# EAGLE design ul-12 (EAGLE 6.4)
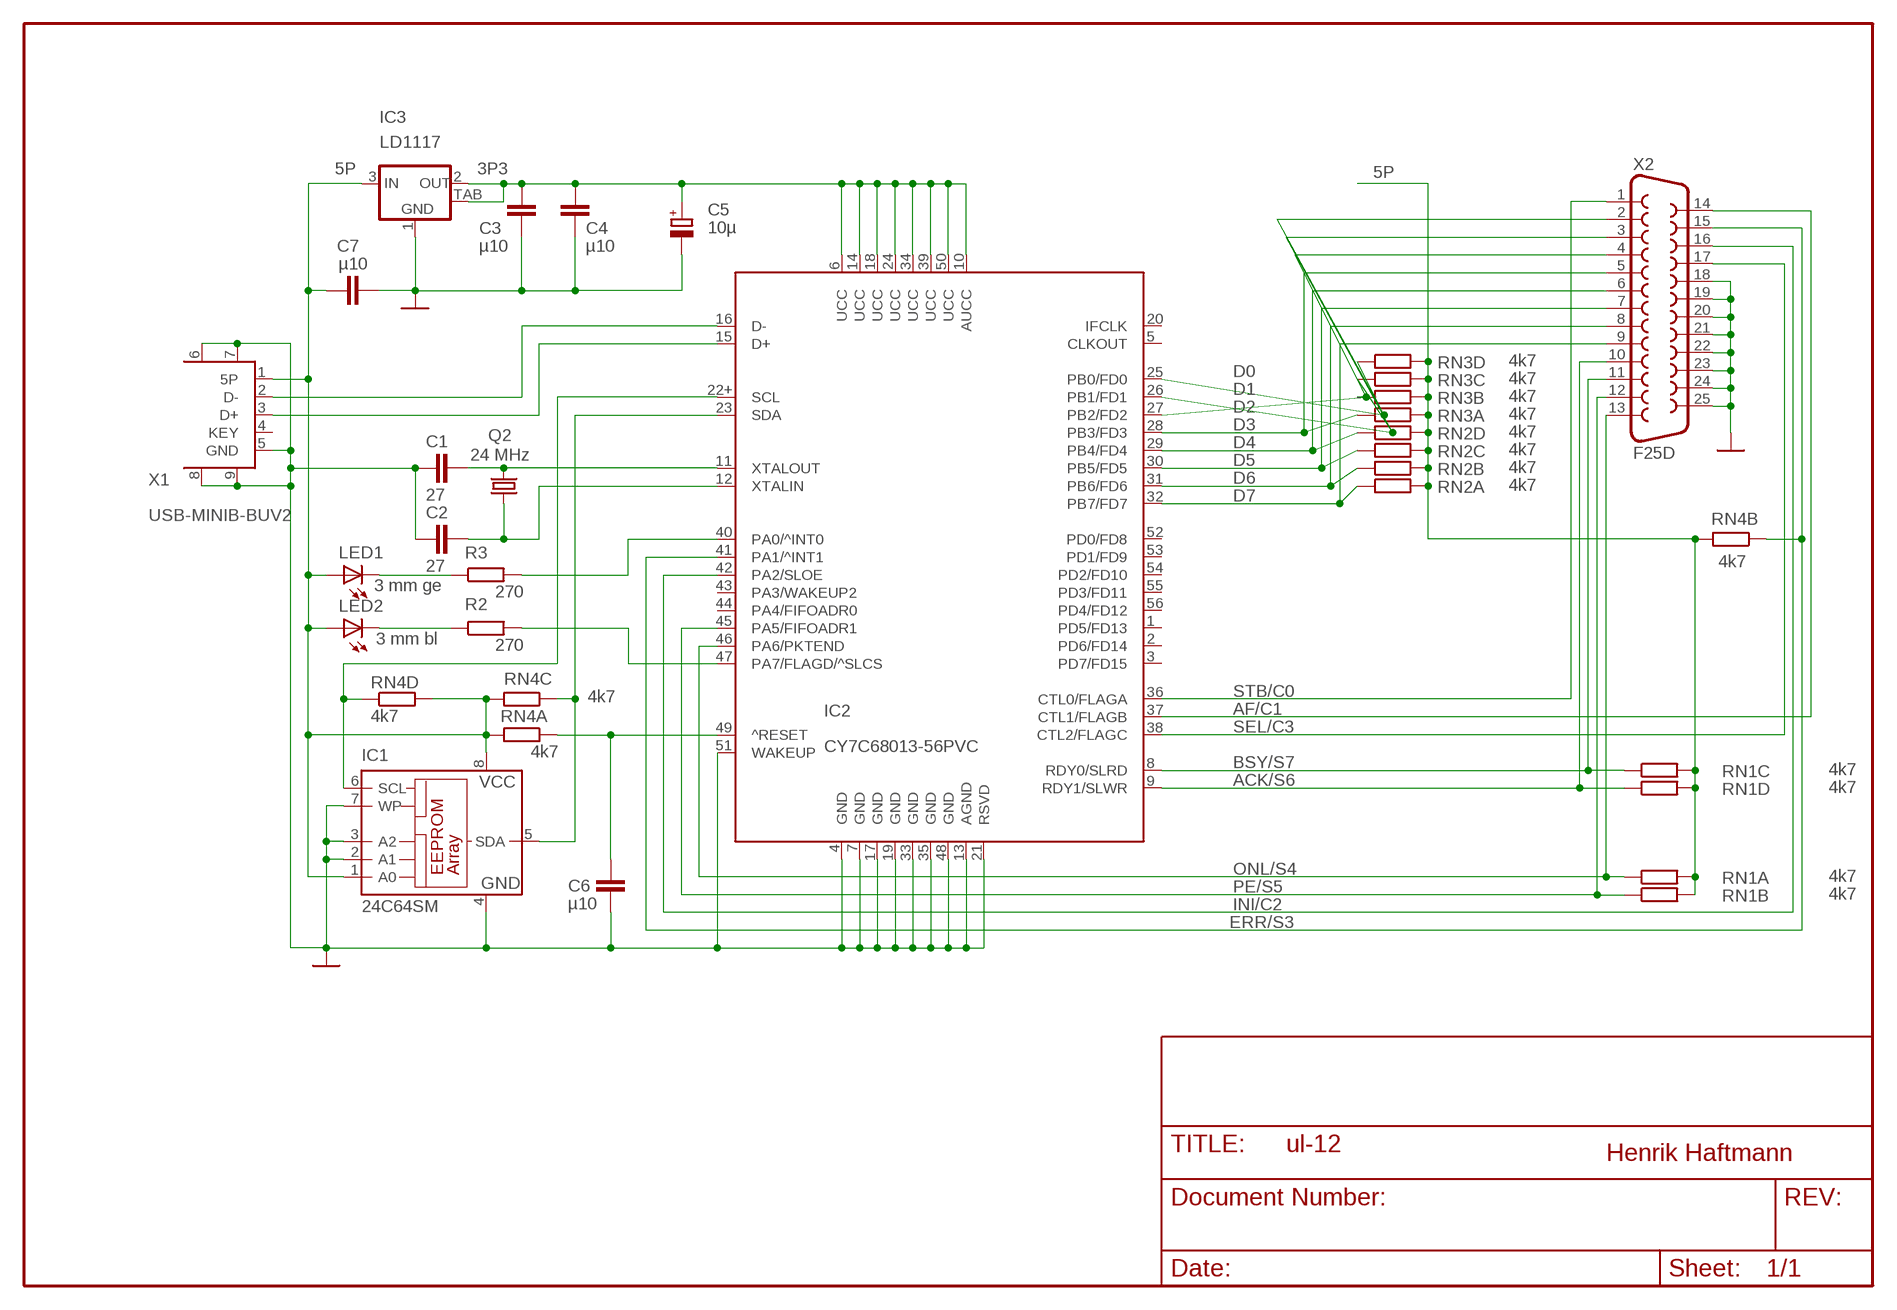
[diagram p0: schematic, sheet 1, part 1 of 2]
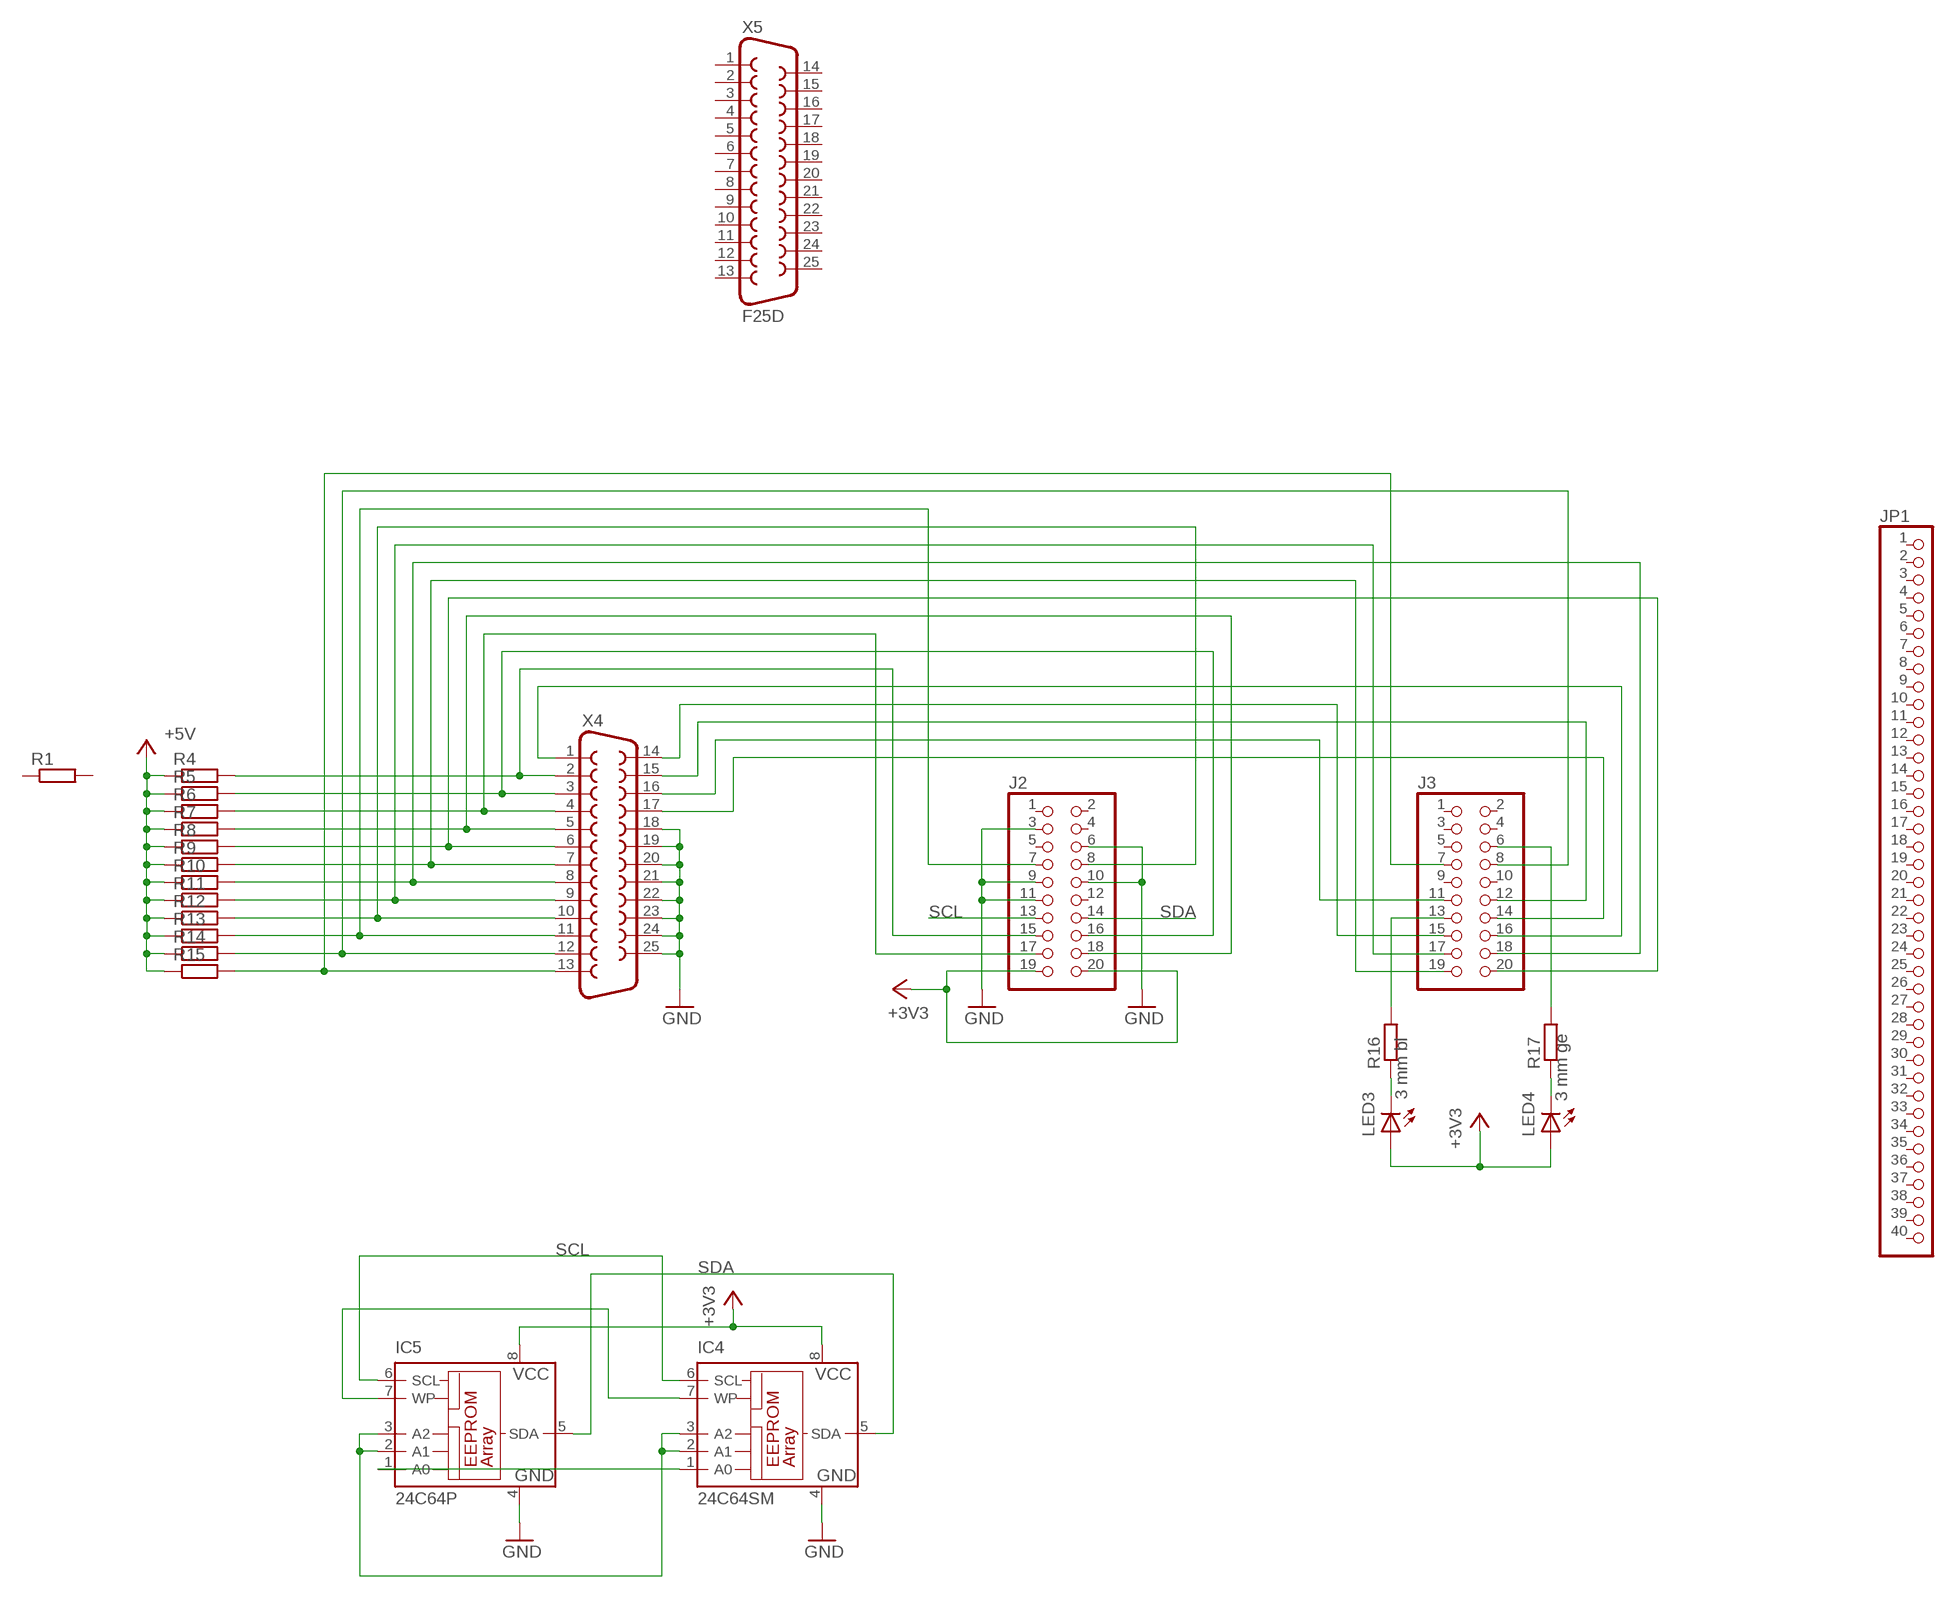
[diagram p1: schematic, sheet 1, part 2 of 2]

## Parts
C1  27  C-EUC0805  [C0805]
C2  27  C-EUC0805  [C0805]
C3  µ10  C-EUC0805  [C0805]
C4  µ10  C-EUC0805  [C0805]
C5  10µ  CPOL-EUC/6032-28R  [C/6032-28R]
C6  µ10  C-EUC0805  [C0805]
C7  µ10  C-EUC0805  [C0805]
IC1  24C64SM  [SO-08M]
IC2  CY7C68013-56PVC  [SSOP56]
IC3  LD1117  LD1117S  [SOT223]
IC4  24C64SM  [SO-08M]
IC5  24C64P  [DIL8]
J2  PINHD-2X10  [2X10]
J3  PINHD-2X10  [2X10]
JP1  PINHD-1X40  [1X40]
LED1  3 mm ge  LED3MM  [LED3MM]
LED2  3 mm bl  LED3MM  [LED3MM]
LED3  3 mm bl  LED3MM  [LED3MM]
LED4  3 mm ge  LED3MM  [LED3MM]
Q2  24 MHz  CRYTALHC49U-V  [HC49U-V]
R1  R-EU_R0805  [R0805]
R2  270  R-EU_R0805  [R0805]
R3  270  R-EU_R0805  [R0805]
R4  R-EU_R0805  [R0805]
R5  R-EU_R0805  [R0805]
R6  R-EU_R0805  [R0805]
R7  R-EU_R0805  [R0805]
R8  R-EU_R0805  [R0805]
R9  R-EU_R0805  [R0805]
R10  R-EU_R0805  [R0805]
R11  R-EU_R0805  [R0805]
R12  R-EU_R0805  [R0805]
R13  R-EU_R0805  [R0805]
R14  R-EU_R0805  [R0805]
R15  R-EU_R0805  [R0805]
R16  R-EU_R0805  [R0805]
R17  R-EU_R0805  [R0805]
RN1  4k7  RN-4P1206  [R-4P]
RN2  4k7  RN-4P1206  [R-4P]
RN3  4k7  RN-4P1206  [R-4P]
RN4  4k7  RN-4P1206  [R-4P]
X1  USB-MINIB-BUV2  [USB-MINIB-BUO]
X2  F25D  [F25D]
X4  F25HP  [F25HP]
X5  F25D  [F25D]

## Nets
3P3: C3.2 C4.2 C5.+ IC2.6(UCC) IC2.10(AUCC) IC2.14(UCC) IC2.18(UCC) IC2.24(UCC) IC2.34(UCC) IC2.39(UCC) IC2.50(UCC) IC3.2(OUT) IC3.TAB(OUT)
5P: C7.2 IC1.1(A0) IC1.8(VCC) IC3.3(IN) LED1.A LED2.A RN1.5 RN1.6 RN1.7 RN1.8 RN2.5 RN2.6 RN2.7 RN2.8 RN3.5 RN3.6 RN3.7 RN3.8 RN4.5 RN4.6 RN4.7 RN4.8 X1.1(5P)
+3V3: IC4.8(VCC) IC5.8(VCC) J2.19 J2.20 LED3.A LED4.A
+5V: R4.1 R5.1 R6.1 R7.1 R8.1 R9.1 R10.1 R11.1 R12.1 R13.1 R14.1 R15.1
ACK/S6: IC2.9(RDY1/SLWR) RN1.4 X2.10
AF/C1: IC2.37(CTL1/FLAGB) X2.14
BSY/S7: IC2.8(RDY0/SLRD) RN1.3 X2.11
D0: IC2.25(PB0/FD0) RN3.4 X2.2
D1: IC2.26(PB1/FD1) RN3.3 X2.3
D2: IC2.27(PB2/FD2) RN3.2 X2.4
D3: IC2.28(PB3/FD3) RN3.1 X2.5
D4: IC2.29(PB4/FD4) RN2.4 X2.6
D5: IC2.30(PB5/FD5) RN2.3 X2.7
D6: IC2.31(PB6/FD6) RN2.2 X2.8
D7: IC2.32(PB7/FD7) RN2.1 X2.9
ERR/S3: IC2.41(PA1/^INT1) RN4.2 X2.15
GND: C1.2 C2.2 C3.1 C4.1 C5.- C6.1 C7.1 IC1.2(A1) IC1.3(A2) IC1.4(GND) IC1.7(WP) IC2.4(GND) IC2.7(GND) IC2.13(AGND) IC2.17(GND) IC2.19(GND) IC2.21(RSVD) IC2.33(GND) IC2.35(GND) IC2.48(GND) IC2.51(WAKEUP) IC3.1(GND) IC4.4(GND) IC5.4(GND) J2.3 J2.6 J2.9 J2.10 J2.11 X1.5(GND) X1.6(GND) X1.7(GND) X1.8(GND) X1.9(GND) X2.18 X2.19 X2.20 X2.21 X2.22 X2.23 X2.24 X2.25 X4.18 X4.19 X4.20 X4.21 X4.22 X4.23 X4.24 X4.25
INI/C2: IC2.42(PA2/SLOE) X2.16
N$1: C2.1 IC2.12(XTALIN) Q2.1
N$2: C1.1 IC2.11(XTALOUT) Q2.2
N$3: IC2.16(D-) X1.2(D-)
N$4: C6.2 IC2.49(^RESET) RN4.1
N$5: LED2.K(C) R2.1
N$6: J3.16 X4.1
N$7: LED1.K(C) R3.1
N$8: IC2.47(PA7/FLAGD/^SLCS) R2.2
N$9: IC2.40(PA0/^INT0) R3.2
N$10: IC1.5(SDA) IC2.23(SDA) RN4.3
N$11: IC1.6(SCL) IC2.22+(SCL) RN4.4
N$12: J2.15 R4.2 X4.2
N$13: J2.16 R5.2 X4.3
N$14: J2.17 R6.2 X4.4
N$15: J2.18 R7.2 X4.5
N$16: J3.20 R8.2 X4.6
N$17: J3.19 R9.2 X4.7
N$18: J3.18 R10.2 X4.8
N$19: J3.17 R11.2 X4.9
N$20: J2.8 R12.2 X4.10
N$21: J2.7 R13.2 X4.11
N$22: J3.8 R14.2 X4.12
N$23: J3.7 R15.2 X4.13
N$24: IC4.7(WP) IC5.7(WP)
N$25: J3.13 R16.2
N$26: LED3.K(C) R16.1
N$27: J3.6 R17.2
N$28: LED4.K(C) R17.1
N$29: IC2.15(D+) X1.3(D+)
N$37: J3.14 X4.17
N$38: J3.11 X4.16
N$39: J3.12 X4.15
N$40: J3.15 X4.14
N$49: IC4.1(A0) IC5.1(A0)
N$50: IC4.2(A1) IC4.3(A2) IC5.2(A1) IC5.3(A2)
ONL/S4: IC2.46(PA6/PKTEND) RN1.1 X2.13
PE/S5: IC2.45(PA5/FIFOADR1) RN1.2 X2.12
SCL: IC4.6(SCL) IC5.6(SCL) J2.13
SDA: IC4.5(SDA) IC5.5(SDA) J2.14
SEL/C3: IC2.38(CTL2/FLAGC) X2.17
STB/C0: IC2.36(CTL0/FLAGA) X2.1
Unconnected: IC2.1(PD5/FD13) IC2.2(PD6/FD14) IC2.3(PD7/FD15) IC2.5(CLKOUT) IC2.20(IFCLK) IC2.43(PA3/WAKEUP2) IC2.44(PA4/FIFOADR0) IC2.52(PD0/FD8) IC2.53(PD1/FD9) IC2.54(PD2/FD10) IC2.55(PD3/FD11) IC2.56(PD4/FD12) J2.1 J2.2 J2.4 J2.5 J2.12 J3.1 J3.2 J3.3 J3.4 J3.5 J3.9 J3.10 JP1.1 JP1.2 JP1.3 JP1.4 JP1.5 JP1.6 JP1.7 JP1.8 JP1.9 JP1.10 JP1.11 JP1.12 JP1.13 JP1.14 JP1.15 JP1.16 JP1.17 JP1.18 JP1.19 JP1.20 JP1.21 JP1.22 JP1.23 JP1.24 JP1.25 JP1.26 JP1.27 JP1.28 JP1.29 JP1.30 JP1.31 JP1.32 JP1.33 JP1.34 JP1.35 JP1.36 JP1.37 JP1.38 JP1.39 JP1.40 R1.1 R1.2 X1.4(KEY) X5.1 X5.2 X5.3 X5.4 X5.5 X5.6 X5.7 X5.8 X5.9 X5.10 X5.11 X5.12 X5.13 X5.14 X5.15 X5.16 X5.17 X5.18 X5.19 X5.20 X5.21 X5.22 X5.23 X5.24 X5.25

## Notes on the sheet
- Henrik Haftmann

## Library data of the parts
C1-C4 C6 C7 = rcl:C-EU: CAPACITOR, European symbol
C5 = rcl:CPOL-EU: POLARIZED CAPACITOR, European symbol
IC1 IC4 IC5 = microchip:24*: Serial EEPROM I2C
IC2 = hs-ul:CY7C68013-56: FX2
IC3 = hs-ul:LD1117: LD1117 Reichelt - Digikey 0,62
J2 J3 = pinhead:PINHD-2X10: PIN HEADER
JP1 = pinhead:PINHD-1X40: PIN HEADER
LED1-LED4 = led:LED: LED OSRAM: - CHIPLED LG R971, LG N971, LY N971, LG Q971, LY Q971, LO R971, LY R971 LH N974, LH R974 LS Q976, LO Q976, LY Q976 LO Q996 - Hyper CHIPLED LW Q18S LB Q993, LB Q99A, LB R99A - SideLED LS A670, LO A670, LY A670, LG A670, LP A670 LB A673, LV A673, LT A673, LW A673 LH A674 LY A675 LS A676, LA A676, LO A676, LY A676, LW A676 LS A679, LY A679, LG A679 - Hyper Micro SIDELED® LS Y876, LA Y876, LO Y876, LY Y876 LT Y87S - SmartLED LW L88C, LW L88S LB L89C, LB L89S, LG L890 LS L89K, LO L89K, LY L89K LS L896, LA L896, LO L896, LY L896 - TOPLED LS T670, LO T670, LY T670, LG T670, LP T670 LSG T670, LSP T670, LSY T670, LOP T670, LYG T670 LG T671, LOG T671, LSG T671 LB T673, LV T673, LT T673, LW T673 LH T674 LS T676, LA T676, LO T676, LY T676, LB T676, LH T676, LSB T676, LW T676 LB T67C, LV T67C, LT T67C, LS T67K, LO T67K, LY T67K, LW E67C LS E67B, LA E67B, LO E67B, LY E67B, LB E67C, LV E67C, LT E67C LW T67C LS T679, LY T679, LG T679 LS T770, LO T770, LY T770, LG T770, LP T770 LB T773, LV T773, LT T773, LW T773 LH T774 LS E675, LA E675, LY E675, LS T675 LS T776, LA T776, LO T776, LY T776, LB T776 LHGB T686 LT T68C, LB T68C - Hyper Mini TOPLED® LB M676 - Mini TOPLED Santana® LG M470 LS M47K, LO M47K, LY M47K Source: http://www.osram.convergy.de/
Q2 = crystal:CRYTAL: CRYSTAL
R1-R17 = rcl:R-EU_: RESISTOR, European symbol
RN1-RN4 = hs-ul:RN-4P: Widerstandsnetzwerk 4 Parallel
X1 = hs-ul:USB-MINIB-BU: USB-MiniB-Buchse Oberflächenmontage irregulär von unten in Leiterplatten-Ausschnitt
X2 X5 = hs-ul:F25: SubD-Buchse korrigiert und verschönert
X4 = con-subd:F25: SUB-D; OC_FARNELL: unknown; OC_NEWARK: unknown

## Board
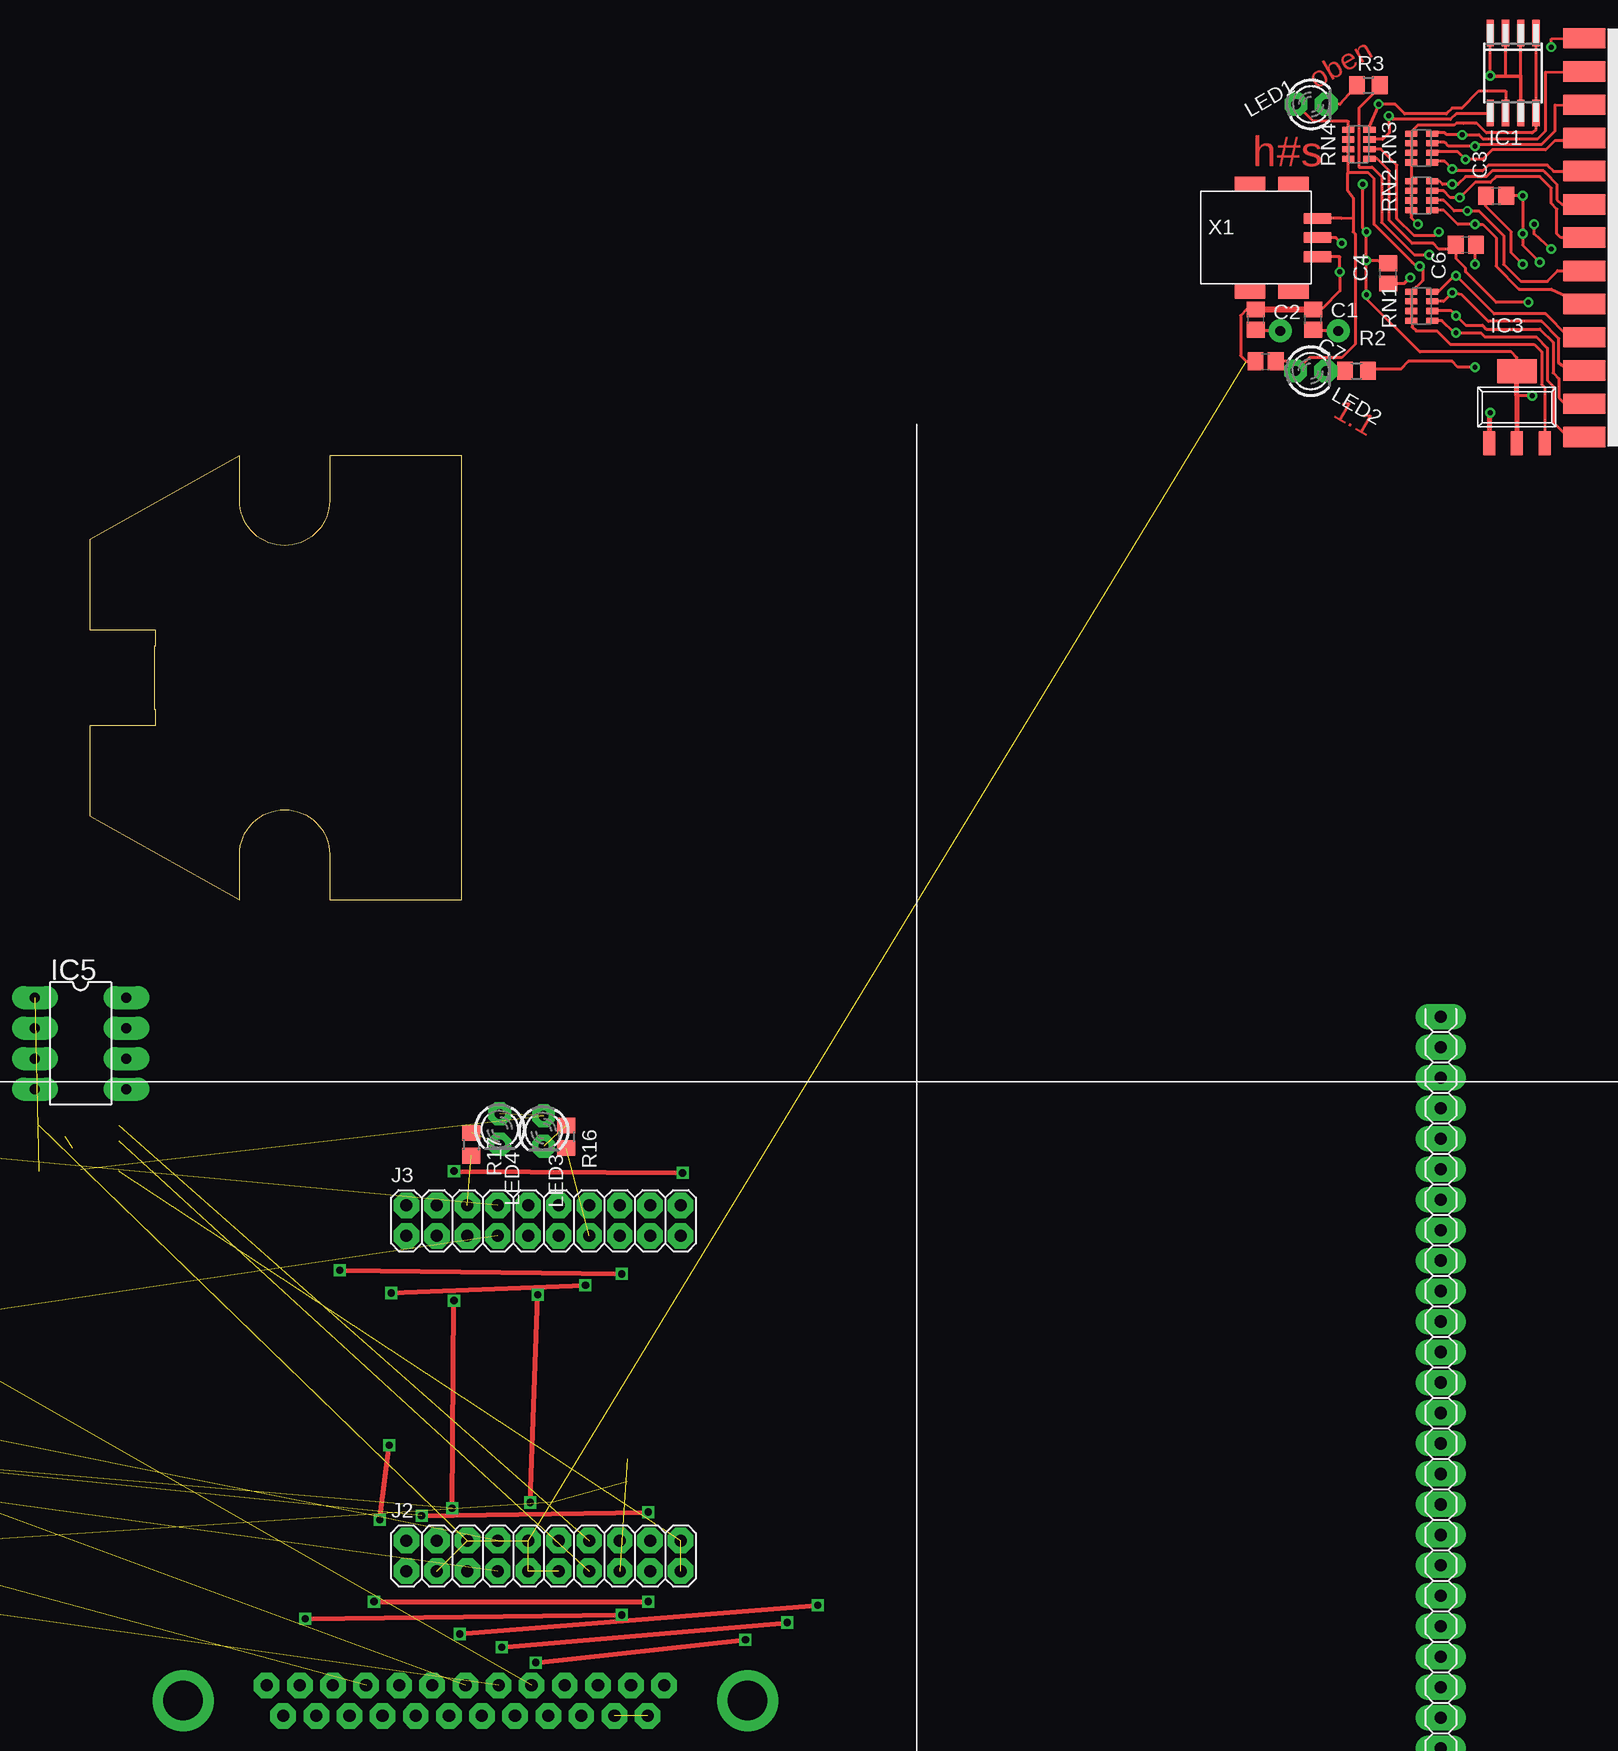
[diagram p2: board, top side]
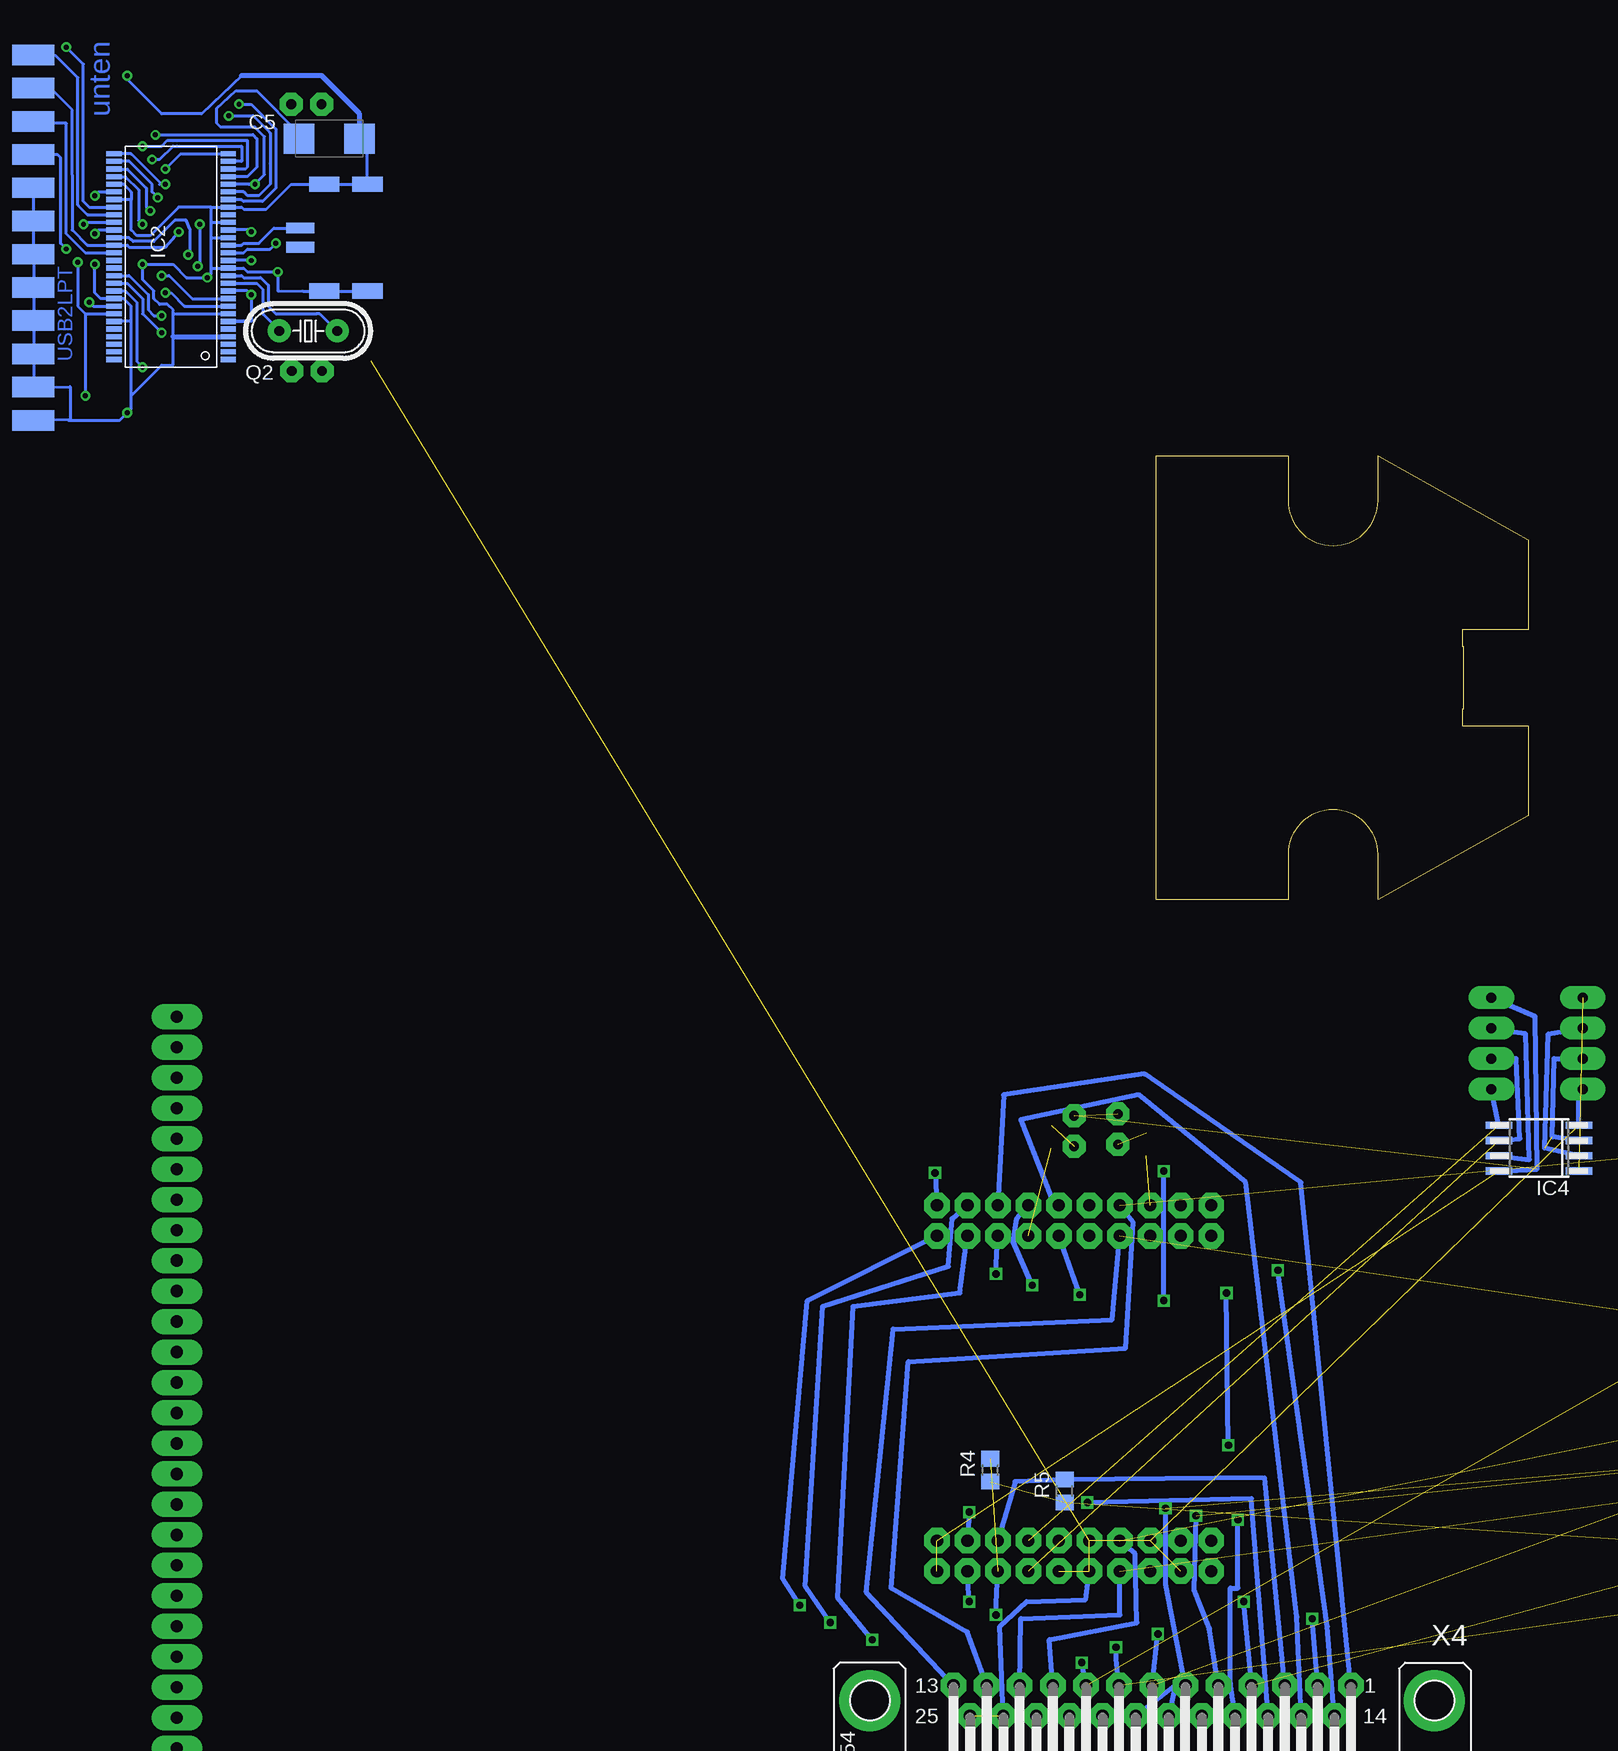
[diagram p3: board, bottom side, seen from below]

Size 31 x 37 mm. Coordinates in mm from the lower left corner, seen from the top.
Outline: 31,0 31,37 20,37 20,33.25 arc-90 16.25,29.5 arc-90 12.5,33.25 12.5,37 0,30 0,22.5 5.46,22.5 5.46,21.14 5.39,21.14 5.39,15.87 5.46,15.87 5.46,14.5 0,14.5 0,7 12.5,0 12.5,3.75 arc-180 20,3.75 20,0 31,0
Copper layers (1*16): Top 0.035mm / dielectric 1.5mm / Bottom 0.035mm
Design rules "DesignRules": minimum track width 8mil, minimum drill 24mil, track to track 0.2mm, track to pad 0.2mm, pad to pad 8mil, via to via 8mil, smd to smd 8mil, copper to edge 10mil, drill to drill 8mil, minimum pad ring 0.55mm, minimum via ring 8mil, stop-mask expansion 4mil, vias tented up to drill 0mil, thermal gap 10mil

### Footprints (pad centres in the part's own frame; a part is rotated, then mirrored left to right if it is on the bottom)
C0805 = smd 1.3 x 1.5: 1 -0.85,0; 2 0.85,0
C/6032-28R = smd 2.55 x 2.5: + 2.525,0; - -2.525,0
SO-08M = smd 0.6 x 2.2: 1 -1.905,-3.33; 2 -0.635,-3.33; 3 0.635,-3.33; 4 1.905,-3.33; 5 1.905,3.33; 6 0.635,3.33; 7 -0.635,3.33; 8 -1.905,3.33
SSOP56 = smd 1.27 x 0.432: 1 -4.763,8.572; 2 -4.763,7.938; 3 -4.763,7.303; 4 -4.763,6.668; 5 -4.763,6.032; 6 -4.763,5.397; 7 -4.763,4.763; 8 -4.763,4.128; 9 -4.763,3.493; 10 -4.763,2.857; 11 -4.763,2.223; 12 -4.763,1.587; 13 -4.763,0.953; 14 -4.763,0.318; 15 -4.763,-0.318; 16 -4.763,-0.953; 17 -4.763,-1.587; 18 -4.763,-2.223; 19 -4.763,-2.857; 20 -4.763,-3.493; 21 -4.763,-4.128; 22+ -4.763,-4.763; 23 -4.763,-5.397; 24 -4.763,-6.032; 25 -4.763,-6.668; 26 -4.763,-7.303; 27 -4.763,-7.938; 28 -4.763,-8.572; 29 4.763,-8.572; 30 4.763,-7.938; 31 4.763,-7.303; 32 4.763,-6.668; 33 4.763,-6.032; 34 4.763,-5.397; 35 4.763,-4.763; 36 4.763,-4.128; 37 4.763,-3.493; 38 4.763,-2.857; 39 4.763,-2.223; 40 4.763,-1.587; 41 4.763,-0.953; 42 4.763,-0.318; 43 4.763,0.318; 44 4.763,0.953; 45 4.763,1.587; 46 4.763,2.223; 47 4.763,2.857; 48 4.763,3.493; 49 4.763,4.128; 50 4.763,4.763; 51 4.763,5.397; 52 4.763,6.032; 53 4.763,6.668; 54 4.763,7.303; 55 4.763,7.938; 56 4.763,8.572
SOT223 = smd 1 x 2: 1 -2.3,-3; 2 0,-3; 3 2.3,-3 | smd 3.3 x 2: TAB 0,3
DIL8 = drill 0.813 long: 1 -3.81,-3.81; 2 -1.27,-3.81; 3 1.27,-3.81; 4 3.81,-3.81; 5 3.81,3.81; 6 1.27,3.81; 7 -1.27,3.81; 8 -3.81,3.81
2X10 = drill 1.016 octagon: 1 -11.43,-1.27; 2 -11.43,1.27; 3 -8.89,-1.27; 4 -8.89,1.27; 5 -6.35,-1.27; 6 -6.35,1.27; 7 -3.81,-1.27; 8 -3.81,1.27; 9 -1.27,-1.27; 10 -1.27,1.27; 11 1.27,-1.27; 12 1.27,1.27; 13 3.81,-1.27; 14 3.81,1.27; 15 6.35,-1.27; 16 6.35,1.27; 17 8.89,-1.27; 18 8.89,1.27; 19 11.43,-1.27; 20 11.43,1.27
1X40 = drill 1.016 long: 1 -49.53,0; 2 -46.99,0; 3 -44.45,0; 4 -41.91,0; 5 -39.37,0; 6 -36.83,0; 7 -34.29,0; 8 -31.75,0; 9 -29.21,0; 10 -26.67,0; 11 -24.13,0; 12 -21.59,0; 13 -19.05,0; 14 -16.51,0; 15 -13.97,0; 16 -11.43,0; 17 -8.89,0; 18 -6.35,0; 19 -3.81,0; 20 -1.27,0; 21 1.27,0; 22 3.81,0; 23 6.35,0; 24 8.89,0; 25 11.43,0; 26 13.97,0; 27 16.51,0; 28 19.05,0; 29 21.59,0; 30 24.13,0; 31 26.67,0; 32 29.21,0; 33 31.75,0; 34 34.29,0; 35 36.83,0; 36 39.37,0; 37 41.91,0; 38 44.45,0; 39 46.99,0; 40 49.53,0
LED3MM = drill 0.813 octagon: A -1.27,0; K 1.27,0
HC49U-V = drill 0.813: 1 -2.413,0; 2 2.413,0
R0805 = smd 1.3 x 1.5: 1 -0.95,0; 2 0.95,0
R-4P = smd 0.508 x 1.016: 1 -1.2,-0.88; 2 -0.4,-0.88; 3 0.4,-0.88; 4 1.2,-0.88; 5 1.2,0.88; 6 0.4,0.88; 7 -0.4,0.88; 8 -1.2,0.88
USB-MINIB-BUO = smd 2.311 x 0.889: 1 9.12,1.6; 3 9.12,0; 5 9.12,-1.6 | smd 2.311 x 0.889 bottom: 2 9.12,0.8; 4 9.12,-0.8 | smd 2.54 x 1.27 bottom: 6 3.52,4.45; 7 7.115,4.45; 8 7.115,-4.45; 9 3.52,-4.45 | smd 2.54 x 1.27: 6@ 3.52,4.45; 7@ 7.115,4.45; 8@ 7.115,-4.45; 9@ 3.52,-4.45
F25D = smd 1.7 x 3.5: 1 -16.612,-2.249; 2 -13.843,-2.249; 3 -11.074,-2.249; 4 -8.306,-2.249; 5 -5.537,-2.249; 6 -2.769,-2.249; 7 0,-2.249; 8 2.769,-2.249; 9 5.537,-2.249; 10 8.306,-2.249; 11 11.074,-2.249; 12 13.843,-2.249; 13 16.612,-2.249 | smd 1.7 x 3.5 bottom: 14 -15.227,-2.249; 15 -12.459,-2.249; 16 -9.69,-2.249; 17 -6.921,-2.249; 18 -4.153,-2.249; 19 -1.384,-2.249; 20 1.384,-2.249; 21 4.153,-2.249; 22 6.921,-2.249; 23 9.69,-2.249; 24 12.459,-2.249; 25 15.227,-2.249
F25HP = drill 1.016 octagon: 1 -16.561,-1.27; 2 -13.792,-1.27; 3 -11.049,-1.27; 4 -8.28,-1.27; 5 -5.512,-1.27; 6 -2.769,-1.27; 7 0,-1.27; 8 2.769,-1.27; 9 5.512,-1.27; 10 8.28,-1.27; 11 11.049,-1.27; 12 13.792,-1.27; 13 16.561,-1.27; 14 -15.189,1.27; 15 -12.421,1.27; 16 -9.652,1.27; 17 -6.909,1.27; 18 -4.14,1.27; 19 -1.372,1.27; 20 1.372,1.27; 21 4.14,1.27; 22 6.909,1.27; 23 9.652,1.27; 24 12.421,1.27; 25 15.189,1.27 | drill 3.302 pad 5.08: G1 -23.52,0; G2 23.52,0

### Placement (x,y rotation side)
C1  101.96,48.35 90 top  (outside the outline)
C2  97.2,48.35 90 top  (outside the outline)
C3  117.2,58.66 0 top  (outside the outline)
C4  108.22,52.19 90 top  (outside the outline)
C5  99.9,63.43 180 bottom  (outside the outline)
C6  114.69,54.56 180 top  (outside the outline)
C7  97.99,44.85 0 top  (outside the outline)
IC1  118.63,68.89 180 top  (outside the outline)
IC2  113.07,53.58 180 bottom  (outside the outline)
IC3  118.95,41.04 0 top  (outside the outline)
IC4  -0.91,-20.71 90 bottom  (outside the outline)
IC5  -0.75,-11.98 270 top  (outside the outline)
J2  37.83,-54.68 0 top  (outside the outline)
J3  37.83,-26.74 0 top  (outside the outline)
JP1  112.6,-59.29 90 top  (outside the outline)
LED1  101.8,66.28 0 top  (outside the outline)
LED2  101.76,44.06 0 top  (outside the outline)
LED3  37.83,-19.28 270 top  (outside the outline)
LED4  34.17,-19.12 270 top  (outside the outline)
Q2  101.64,47.39 180 bottom  (outside the outline)
R1  -18.85,-48.97 90 bottom  (outside the outline)
R2  105.57,44.06 0 top  (outside the outline)
R3  106.56,67.87 0 top  (outside the outline)
R4  44.81,-47.54 90 bottom  (outside the outline)
R5  38.62,-49.29 90 bottom  (outside the outline)
R6  -31.23,-51.67 90 bottom  (outside the outline)
R7  -42.5,-45.16 90 bottom  (outside the outline)
R8  -46.63,-45.16 90 bottom  (outside the outline)
R9  -44.88,-38.33 90 bottom  (outside the outline)
R10  -28.69,-55.64 270 bottom  (outside the outline)
R11  -40.44,-22.3 90 bottom  (outside the outline)
R12  -66.16,-34.2 90 bottom  (outside the outline)
R13  -65.04,-43.25 90 bottom  (outside the outline)
R14  -77.74,-15.95 90 bottom  (outside the outline)
R15  -75.52,-45.16 90 bottom  (outside the outline)
R16  39.73,-19.76 270 top  (outside the outline)
R17  31.79,-20.39 270 top  (outside the outline)
RN1  111.01,49.46 90 top  (outside the outline)
RN2  111.01,58.66 90 top  (outside the outline)
RN3  111.01,62.63 90 top  (outside the outline)
RN4  105.77,62.95 90 top  (outside the outline)
X1  93.2,55.17 0 top  (outside the outline)
X2  126.82,55.17 270 top  (outside the outline)
X4  31.32,-66.75 180 bottom  (outside the outline)
X5  146.57,7.71 0 top  (outside the outline)

### Tracks (layer width: path | path; a pad name or v marks a point on that pad's centre or on a via)
3P3  (via drill 0.41)
  Top 0.254: v119.42,58.66 v119.42,55.49 119.42,54.54 v120.85,53.11 | v106.09,59.62 106.09,55.97 v106.41,55.65 v106.41,53.27 | v106.41,53.27 v106.41,50.41 106.41,50.09 110.85,45.65 118.47,45.65 118.95,45.17 118.95,44.38 | C4.2 107.59,53.04 107.36,53.27 v106.41,53.27 | v119.42,58.66 C3.2 | v119.42,58.66 | v120.22,42 118.95,42
  Top 0.406: IC3.TAB 118.95,44.06 | IC3.TAB 118.95,42 IC3.2 | IC3.TAB 118.95,44.38
  Bottom 0.254: IC2.34 119.11,58.98 v119.42,58.66 | v119.42,55.49 119.11,55.81 IC2.39 | IC2.39 | v106.41,53.27 IC2.14 | IC2.18 | IC2.24 106.56,59.62 v106.09,59.62 | 106.72,48.19 IC2.6 106.41,48.19 v106.41,50.41 106.72,50.73 IC2.10 | IC2.50 | 120.22,48.82 IC2.50 | 120.22,48.82 v120.22,42 | IC2.18 106.56,55.81 v106.41,55.65 | 120.22,48.82 120.85,49.46 v120.85,53.11 | v106.09,59.62 | v106.09,59.62 105.3,60.41 105.3,63.59 106.09,64.38 108.95,64.38 109.26,64.7 109.26,65.97 107.68,67.4 105.93,67.4 102.42,63.89 C5.+
5P  (via drill 0.41)
  Top 0.254: RN2.8 110.13,56.85 v110.69,56.28 | 110.13,63.11 RN3.6 RN3.7 | 110.13,63.11 RN3.5 110.13,63.98 110.69,64.54 113.71,64.54 113.87,64.7 114.5,64.7 115.45,64.7 115.61,64.7 116.41,63.9 120.22,63.9 120.53,64.22 IC1.8 | 110.13,63.11 110.22,63.11 | RN3.7 110.13,62.16 110.22,62.16 | RN3.7 RN3.8 | RN3.8 110.13,61.36 110.22,61.36 | RN3.8 RN2.5 | RN2.5 110.13,59.46 | RN2.5 RN2.6 | RN2.6 110.13,58.66 | RN2.6 RN2.7 | RN2.7 110.13,57.87 | RN2.8 110.13,57.08 | RN2.7 RN2.8 | LED1.A | LED1.A 101.96,64.86 104.82,64.86 104.88,64.86 104.89,64.86 RN4.5 104.89,63.43 | RN1.6 RN1.5 111.08,51.59 111.08,52.56 v110.85,52.79 110.53,52.79 110.22,53.11 107.04,56.28 107.04,60.09 106.56,60.57 104.89,60.57 | RN1.6 110.13,49.77 110.22,49.77 | 110.13,49.14 RN1.7 RN1.8 110.13,48.19 110.22,48.19 110.22,47.71 110.53,47.39 112.28,47.39 113.39,46.28 120.38,46.28 121.01,45.65 121.01,42.95 121.25,42.71 IC3.3 | RN1.6 110.13,49.14 | 110.13,49.14 110.22,49.14 | 105.3,56.76 105.3,55.65 105.45,55.49 105.45,46.28 104.34,45.17 101.64,45.17 100.53,44.06 | 104.89,63.43 RN4.6 104.89,62.63 | 104.89,63.43 104.98,63.43 | 104.89,62.63 RN4.7 RN4.8 | 104.89,62.63 104.98,62.63 | RN4.8 104.89,61.68 104.98,61.68 | 104.89,60.57 RN4.8 | 104.89,60.57 104.82,60.57 104.82,59.14 105.3,58.51 105.3,56.76 | IC1.8 120.53,65.65 | IC1.8 IC1.1 | 100.53,44.06 LED2.A | C7.2 99.74,44.85 100.53,44.06 | X1.1 104.34,56.77 105.3,56.76
  Bottom 0.254: v110.69,56.28 110.69,52.95 v110.85,52.79
+3V3  (4 unrouted)
  Bottom 0.406: IC4.8 -0.75,-22.46 -0.59,-9.76 IC5.8
+5V  (11 unrouted)
ACK/S6  (via drill 0.41)
  Top 0.254: X2.10 123.57,46.9 123.55,46.92 123.23,46.92 121.33,48.82 117.04,48.82 v113.87,52 113.71,52 112.37,50.66 RN1.4
  Bottom 0.254: IC2.9 | IC2.9 111.33,50.09 113.23,52 v113.87,52
AF/C1
  Bottom 0.254: X2.14 122.69,70.34 120.85,68.51 120.85,57.87 120.06,57.08 IC2.37 | IC2.37
BSY/S7  (via drill 0.41)
  Top 0.254: X2.11 123.39,44.06 122.44,44.69 122.44,46.76 121.01,48.19 116.57,48.19 114.34,50.41 v113.55,50.57 112.84,49.86 RN1.3
  Bottom 0.254: IC2.8 | v113.55,50.57 113.07,50.57 111.96,49.46 IC2.8
D0  (via drill 0.41)
  Top 0.254: RN3.4 111.96,63.9 112.92,63.9 113.07,63.74 v114.39,63.73 115.77,63.74 116.09,63.43 120.69,63.43 121.33,64.06 121.33,68.96 X2.2
  Bottom 0.254: IC2.25 106.72,60.25 105.93,61.05 105.93,63.43 106.25,63.74 114.34,63.74 114.36,63.73 v114.39,63.73
D1  (via drill 0.41)
  Top 0.254: RN3.3 111.96,63.11 112.92,63.11 113.23,62.79 v115.45,62.79 115.61,62.95 121.01,62.95 122.12,64.06 122.12,66.21 X2.3
  Bottom 0.254: 106.72,61.05 | 106.72,61.05 106.88,60.89 IC2.26 | 106.72,61.05 106.72,63.27 113.39,63.27 113.87,62.79 v115.45,62.79
D2  (via drill 0.41)
  Top 0.254: RN3.2 111.8,62.32 114.03,62.32 v114.66,61.68 116.09,61.68 116.88,62.47 | X2.4 124.4,63.27 122.12,63.27 121.33,62.47 116.88,62.47 | 116.88,62.47
  Bottom 0.254: IC2.27 107.2,61.52 107.2,62.79 112.6,62.79 112.92,62.79 114.03,61.68 v114.66,61.68
D3  (via drill 0.41)
  Top 0.254: 111.96,61.52 112.92,61.52 v113.55,60.89 113.71,60.73 | 111.96,61.52 111.8,61.52 RN3.1 111.89,61.45 111.96,61.52 | 113.71,60.73 116.09,60.73 116.57,61.2 121.49,61.2 122,60.69 X2.5 | 113.71,60.73
  Bottom 0.254: 112.28,62.16 IC2.28 | 112.28,62.16 | v113.55,60.89 112.28,62.16
D4  (via drill 0.41)
  Top 0.254: RN2.4 112.53,59.86 112.76,59.62 114.03,59.62 | 114.03,59.62 v113.55,59.62 114.03,59.62 | X2.6 122.7,57.93 122.28,58.35 122.28,59.62 121.33,60.57 | 121.33,60.57 | 121.33,60.57 121.17,60.73 116.88,60.73 116.41,60.25 114.66,60.25 114.03,59.62
  Bottom 0.254: IC2.29 116.41,62.16 113.87,59.62 v113.55,59.62 114.03,59.61
D5  (via drill 0.41)
  Top 0.254: 115.3,59.62 v114.19,58.51 | 115.3,59.62 | RN2.3 112.83,59.06 113.39,58.51 v114.19,58.51 | v114.19,58.51 | X2.7 122.6,55.17 122.28,55.49 122.28,57.55 121.81,58.03 121.81,59.3 120.85,60.25 117.2,60.25 116.72,59.78 115.45,59.78 115.3,59.62
  Bottom 0.254: IC2.30 116.57,61.52 114.66,59.62 114.66,58.98 | v114.19,58.51 114.66,58.98 | 114.66,58.98
D6  (via drill 0.41)
  Top 0.254: 114.98,57.39 | X2.8 122.34,52.41 121.49,51.52 119.27,51.52 117.84,52.95 117.84,55.33 115.77,57.39 114.98,57.39 | 114.98,57.39 v114.82,57.39 113.71,57.39 112.84,58.26 RN2.2 | 114.98,57.39
  Bottom 0.254: IC2.31 116.72,60.89 115.14,59.3 115.14,57.71 v114.82,57.39
D7  (via drill 0.41)
  Top 0.254: v115.45,56.28 | X2.9 121.81,50.89 119.11,50.89 117.2,52.79 117.2,55.17 116.09,56.28 v115.45,56.28 | RN2.1 112.84,57.46 114.03,56.28 v115.45,56.28
  Bottom 0.254: v115.45,56.28 115.77,56.6 115.77,59.14 116.88,60.25 IC2.32
ERR/S3  (via drill 0.41)
  Top 0.254: v112.44,55.65 | v112.44,55.65 112.12,55.33 110.38,55.33 108.95,56.76 108.95,61.2 107.6,62.55 RN4.2
  Bottom 0.254: X2.15 124.58,67.4 122.92,67.4 121.33,65.81 121.33,60.41 121.33,55.81 120.06,54.54 IC2.41 116.72,54.54 116.57,54.38 114.5,54.38 113.55,54.38 v112.44,55.65
GND  (via drill 0.41)  (7 unrouted)
  Top 0.254: C7.1 96.41,44.85 95.93,45.33 95.93,48.66 96.41,49.14 97.04,49.14 | 101.96,49.14 C1.2 | C2.2 97.2,49.14 97.04,49.14 | 97.04,49.14 97.2,49.3 102.75,49.3 104.18,50.73 v104.18,52.31 104.18,53.57 X1.5 | C4.1 109.56,51.34 109.74,51.52 v110.06,51.84 | C6.1 115.59,54.56 115.61,54.54 115.45,54.38 v115.45,52.95 | C3.1 116.35,57.77 118.47,55.65 118.47,53.9 v119.42,52.95 | v119.42,52.95 | 119.27,68.63 IC1.2 | 118,68.63 119.27,68.63 | 118,68.63 IC1.3 | 119.27,68.63 IC1.7 119.27,68.67 v116.72,68.67 | 118,68.63 116.72,68.63 v116.72,68.67 | v116.72,68.67 IC1.4
  Top 0.406: 97.2,49.14 101.96,49.14 | IC3.1 116.65,40.49 v116.72,40.57
  Bottom 0.254: IC2.35 | IC2.33 117.04,59.62 116.41,58.98 | X1.9 100.53,50.72 100.53,50.73 100.53,50.72 | 116.41,58.98 | 116.41,58.35 IC2.35 | 116.41,58.98 116.41,58.35 | 100.53,50.72 X1.8 | 116.41,58.35 116.41,55.81 115.93,55.33 114.82,55.33 112.44,57.71 109.74,57.71 | 100.53,50.72 102.11,50.72 104.18,50.73 v104.18,52.31 | IC2.21 | v104.18,52.31 104.22,52.3 | v104.18,52.31 106.72,52.31 107.04,52.63 IC2.13 | 109.74,57.71 IC2.21 | 109.74,56.44 109.74,57.71 | 109.74,56.44 IC2.19 | 109.74,55.17 109.74,56.44 | 109.74,55.17 IC2.17 | IC2.13 | 109.74,52.63 IC2.13 | 109.74,52.63 109.74,55.17 | 109.74,52.63 IC2.13 | 109.74,52.63 109.74,52.16 v110.06,51.84 | v110.06,51.84 | v110.06,51.84 111.8,51.84 112.92,52.95 v115.45,52.95 115.45,51.68 114.5,50.73 114.5,50.09 114.03,49.62 113.39,49.62 112.92,49.14 112.92,48.82 | v119.42,52.95 119.42,50.57 118.95,50.09 IC2.48 | 112.92,48.82 IC2.7 | IC2.48 | 112.92,48.82 | 112.92,46.92 112.92,48.82 | 112.92,46.92 | IC2.48 117.04,50.09 116.41,49.46 116.41,48.19 | 112.92,46.92 112.92,44.54 113.87,44.54 116.41,42 | 116.41,48.19 IC2.51 | 116.41,42 116.41,48.19 | 116.41,42 116.41,40.88 v116.72,40.57 117.36,39.93 119.11,39.93 121.65,39.93 121.49,39.91 121.49,40 | 121.49,40 X2.25 | 121.49,40 121.49,42.76 X2.24 124.53,42.76 124.53,45.52 | 124.53,45.52 X2.23 | X2.18 124.53,59.31 124.53,56.55 | 124.53,48.28 X2.22 | 124.53,48.28 124.53,45.52 | 124.53,51.03 X2.21 | 124.53,51.03 124.53,48.28 | 124.53,56.55 X2.19 | 124.53,53.79 124.53,56.55 | 124.53,53.79 124.53,51.03 | X2.20 124.53,53.79 | 96.88,59.62 96.72,59.78 | 96.72,59.78 X1.6 99.44,59.62 X1.7 100.53,59.62 103.07,59.62 105.14,57.55 107.04,57.55 107.2,57.71 IC2.21 | 96.72,59.78 96.72,62.79 97.36,63.43 C5.-
  Bottom 0.254: 107.2,68.67 110.53,65.49 113.87,65.49 116.72,68.35 v116.72,68.67
  Bottom 0.406: 112.92,46.92 IC2.4 | 97.36,63.43 97.36,65.49 100.53,68.67 107.2,68.67 | 99.44,59.62 99.42,59.62 | IC4.4 -4.24,-15.79 IC5.4 | X4.18 X4.19 29.41,-65.48 X4.20 X4.21 X4.22 X4.23 X4.24 44.02,-60.56 41.8,-58.49 36.87,-58.33 J2.9
INI/C2
  Bottom 0.254: X2.16 124.58,64.7 121.81,64.7 121.81,55.49 120.22,53.9 IC2.42
N$1
  Top 0.254: 99.26,47.39 Q2.1 97.2,47.39 C2.1
  Bottom 0.254: IC2.12 107.2,52 107.04,51.84 105.61,51.84 104.98,51.2 104.98,49.46 104.34,48.82 100.98,48.82 100.69,48.82 99.26,47.39 Q2.1
N$2
  Top 0.254: C1.1 101.96,47.39 Q2.2
  Bottom 0.254: IC2.11 105.93,51.36 105.45,50.89 105.45,48.82 104.06,47.42 Q2.2
N$3
  Bottom 0.254: X1.2 104.5,55.97 105.77,54.7 107.04,54.7 107.2,54.54 108.15,54.54 IC2.16
N$4  (via drill 0.41)
  Top 0.254: v119.9,49.77 117.2,49.77 114.66,52.31 114.66,52.63 113.87,53.43 113.87,54.54 C6.2 113.5,54.22 112.44,54.22 111.96,54.7 110.22,54.7 108.31,56.6 108.31,60.73 107.29,61.75 RN4.1
  Bottom 0.254: IC2.49 119.58,49.46 v119.9,49.77
N$5
  Top 0.254: LED2.K 103.07,44.06 R2.1
N$6
  Bottom 0.406: X4.1 18.94,-23.57 31.95,-14.52 43.7,-16.27 J3.16
N$7
  Top 0.254: LED1.K 104.18,66.28 R3.1
N$8  (via drill 0.41)
  Top 0.254: 106.42,44.22 R2.2 | 106.42,44.22 106.42,44.55 | v115.45,44.38 114.03,44.38 113.55,44.85 109.9,44.85 109.26,44.22 106.42,44.22 | 106.42,44.22 106.41,44.22
  Bottom 0.254: IC2.47 | IC2.47 116.88,50.73 115.93,49.77 115.93,44.85 v115.45,44.38
N$9  (via drill 0.41)
  Top 0.254: v111.64,53.74 110.38,53.74 107.68,56.44 107.68,60.25 106.88,61.05 105.77,61.05 105.77,65.97 107.42,67.61 R3.2
  Bottom 0.254: IC2.40 116.57,55.17 116.25,54.85 114.5,54.85 112.76,56.6 111.8,56.6 111.49,55.81 111.49,53.9 v111.64,53.74
N$10  (via drill 0.41)
  Top 0.254: IC1.5 116.57,65.49 113.87,65.49 113.39,65.01 108.63,65.01 v108.27,65.31 108.31,63.9 107.76,63.35 RN4.3
  Bottom 0.254: v108.27,65.31 106.25,65.33 104.82,63.9 104.82,61.36 104.82,59.62 105.77,58.66 106.72,58.66 107.04,58.98 108.15,58.98 IC2.23
N$11  (via drill 0.41)
  Top 0.254: IC1.6 118,67.4 115.77,67.4 114.34,65.97 113.55,65.97 113.07,65.49 109.58,65.49 108.79,66.28 v107.42,66.3 106.65,64.47 RN4.4
  Bottom 0.254: v107.42,66.3 106.41,66.28 104.34,64.22 104.34,59.3 105.45,58.19 107.04,58.19 107.2,58.35 IC2.22+ | IC2.22+
N$12  (via drill 0.6)  (1 unrouted)
  Top 0.406: v17.98,-59.92 v44.34,-59.6
  Bottom 0.406: X4.2 v17.98,-59.92 | v44.34,-59.6 J2.15
N$13
  Bottom 0.406: X4.3 21.95,-48.17 R5.2 42.75,-48.49 J2.16
N$14  (via drill 0.6)  (1 unrouted)
  Top 0.406: v23.7,-58.49 v46.56,-58.49
  Bottom 0.406: X4.4 v23.7,-58.49 | v46.56,-58.49 J2.17
N$15  (via drill 0.6)  (1 unrouted)
  Top 0.406: v27.67,-51.35 v46.56,-51.03
  Bottom 0.406: X4.5 26.55,-60.72 27.82,-57.54 v27.67,-51.35 | v46.56,-51.03 J2.18
N$16  (via drill 0.6)  (1 unrouted)
  Top 0.406: v30.21,-50.71 v30.36,-33.41 | v30.36,-22.62 v49.41,-22.77
  Bottom 0.406: X4.6 30.21,-57.06 v30.21,-50.71 | v30.36,-33.41 v30.36,-22.62 | v49.41,-22.77 J3.20
N$17  (via drill 0.6)  (1 unrouted)
  Top 0.406: v30.84,-61.19 v60.69,-58.81
  Bottom 0.406: X4.7 v30.84,-61.19 | v60.69,-58.81 62.11,-56.59 60.05,-33.41 J3.19
N$18  (via drill 0.6)  (1 unrouted)
  Top 0.406: v34.33,-62.3 v58.15,-60.24
  Bottom 0.406: X4.8 34.33,-63.26 v34.33,-62.3 | v58.15,-60.24 60.21,-57.22 58.78,-33.89 48.3,-30.55 47.99,-26.58 J3.18
N$19  (via drill 0.6)  (1 unrouted)
  Top 0.406: v37.19,-63.57 v54.65,-61.67
  Bottom 0.406: X4.9 v37.19,-63.57 | v54.65,-61.67 57.51,-58.18 56.24,-33.89 47.35,-32.78 J3.17
N$20  (1 unrouted)
  Bottom 0.406: X4.10 39.89,-61.67 32.59,-60.24 32.75,-54.52 J2.8
N$21  (1 unrouted)
  Bottom 0.406: X4.11 42.27,-59.92 34.02,-59.6 J2.7
N$22  (1 unrouted)
  Bottom 0.406: X4.12 46.72,-61.03 53.07,-57.38 51.64,-38.49 33.54,-37.38 32.91,-26.9 J3.8
N$23  (1 unrouted)
  Bottom 0.406: X4.13 55.13,-57.7 52.91,-35.79 34.65,-35 J3.7
N$24
  Bottom 0.406: IC4.7 -0.11,-21.66 0.2,-11.19 2.58,-10.87 IC5.7
N$25  (1 unrouted)
N$26  (1 unrouted)
N$27  (1 unrouted)
N$28  (1 unrouted)
N$29  (via drill 0.41)
  Top 0.254: X1.3 103.87,55.17 v104.34,54.7
  Bottom 0.254: IC2.15 | IC2.15 107.04,53.9 106.72,54.22 104.82,54.22 v104.34,54.7
N$37  (via drill 0.6)
  Top 0.406: v24.17,-51.67 v24.97,-45.48 | v25.13,-32.78 v41.32,-32.14
  Bottom 0.406: X4.17 24.81,-65.32 24.81,-57.38 24.17,-57.38 v24.17,-51.67 | v24.97,-45.48 v25.13,-32.78 | v41.32,-32.14 42.91,-28.49 42.59,-26.58 J3.14
N$38  (via drill 0.6)
  Top 0.406: v36.72,-50.24 v37.35,-32.93
  Bottom 0.406: X4.16 23.06,-49.92 v36.72,-50.24 | v37.35,-32.93 J3.11
N$39
  Bottom 0.406: X4.15 19.25,-59.76 23.54,-23.57 32.43,-16.27 42.27,-18.33 39.26,-25.95 J3.12
N$40  (via drill 0.6)
  Top 0.406: v20.84,-30.87 v44.34,-31.19
  Bottom 0.406: X4.14 16.71,-60.56 v20.84,-30.87 | v44.34,-31.19 J3.15
N$49  (1 unrouted)
N$50  (1 unrouted)
  Bottom 0.406: IC4.2 -1.38,-20.71 -1.7,-11.19 IC5.2 | IC4.3 -2.02,-19.76 -2.18,-13.25 IC5.3
ONL/S4  (via drill 0.41)
  Top 0.254: X2.13 123.12,38.62 122.92,38.82 121.96,39.77 121.96,42.79 121.49,43.27 121.49,45.96 120.56,46.89 116.28,46.89 115.93,47.23 v113.87,47.23 113.71,47.23 112.69,48.26 RN1.1
  Bottom 0.254: IC2.46 | IC2.46 116.72,51.36 115.45,50.09 115.45,48.82 v113.87,47.23
PE/S5  (via drill 0.41)
  Top 0.254: X2.12 122.9,41.38 122.44,41.84 122.44,43.42 121.96,43.9 121.96,46.44 120.85,47.55 116.41,47.55 116.09,47.87 114.66,47.87 v113.87,48.66 113.47,49.06 RN1.2
  Bottom 0.254: IC2.45 | IC2.45 116.57,52 114.98,50.41 114.98,49.14 114.5,48.66 v113.87,48.66
SCL  (1 unrouted)
  Bottom 0.406: IC4.6 0.68,-19.92 1,-13.25 IC5.6
SDA  (1 unrouted)
  Bottom 0.406: IC4.5 IC5.5
SEL/C3  (via drill 0.41)
  Top 0.254: v120.38,56.28 120.38,55.49 v121.81,54.22
  Bottom 0.254: IC2.38 | IC2.38 120.22,56.44 v120.38,56.28 | v121.81,54.22 | v121.81,54.22 122.28,54.7 122.28,61.84 122.51,62.07 X2.17
STB/C0  (via drill 0.41)
  Top 0.254: X2.1 121.81,71.72 v121.81,71.05
  Bottom 0.254: v121.81,71.05 120.38,69.62 120.38,58.19 119.9,57.71 IC2.36 | IC2.36

### Text on the board
Top: oben | h#s | 1.1
Bottom: unten | USB2LPT